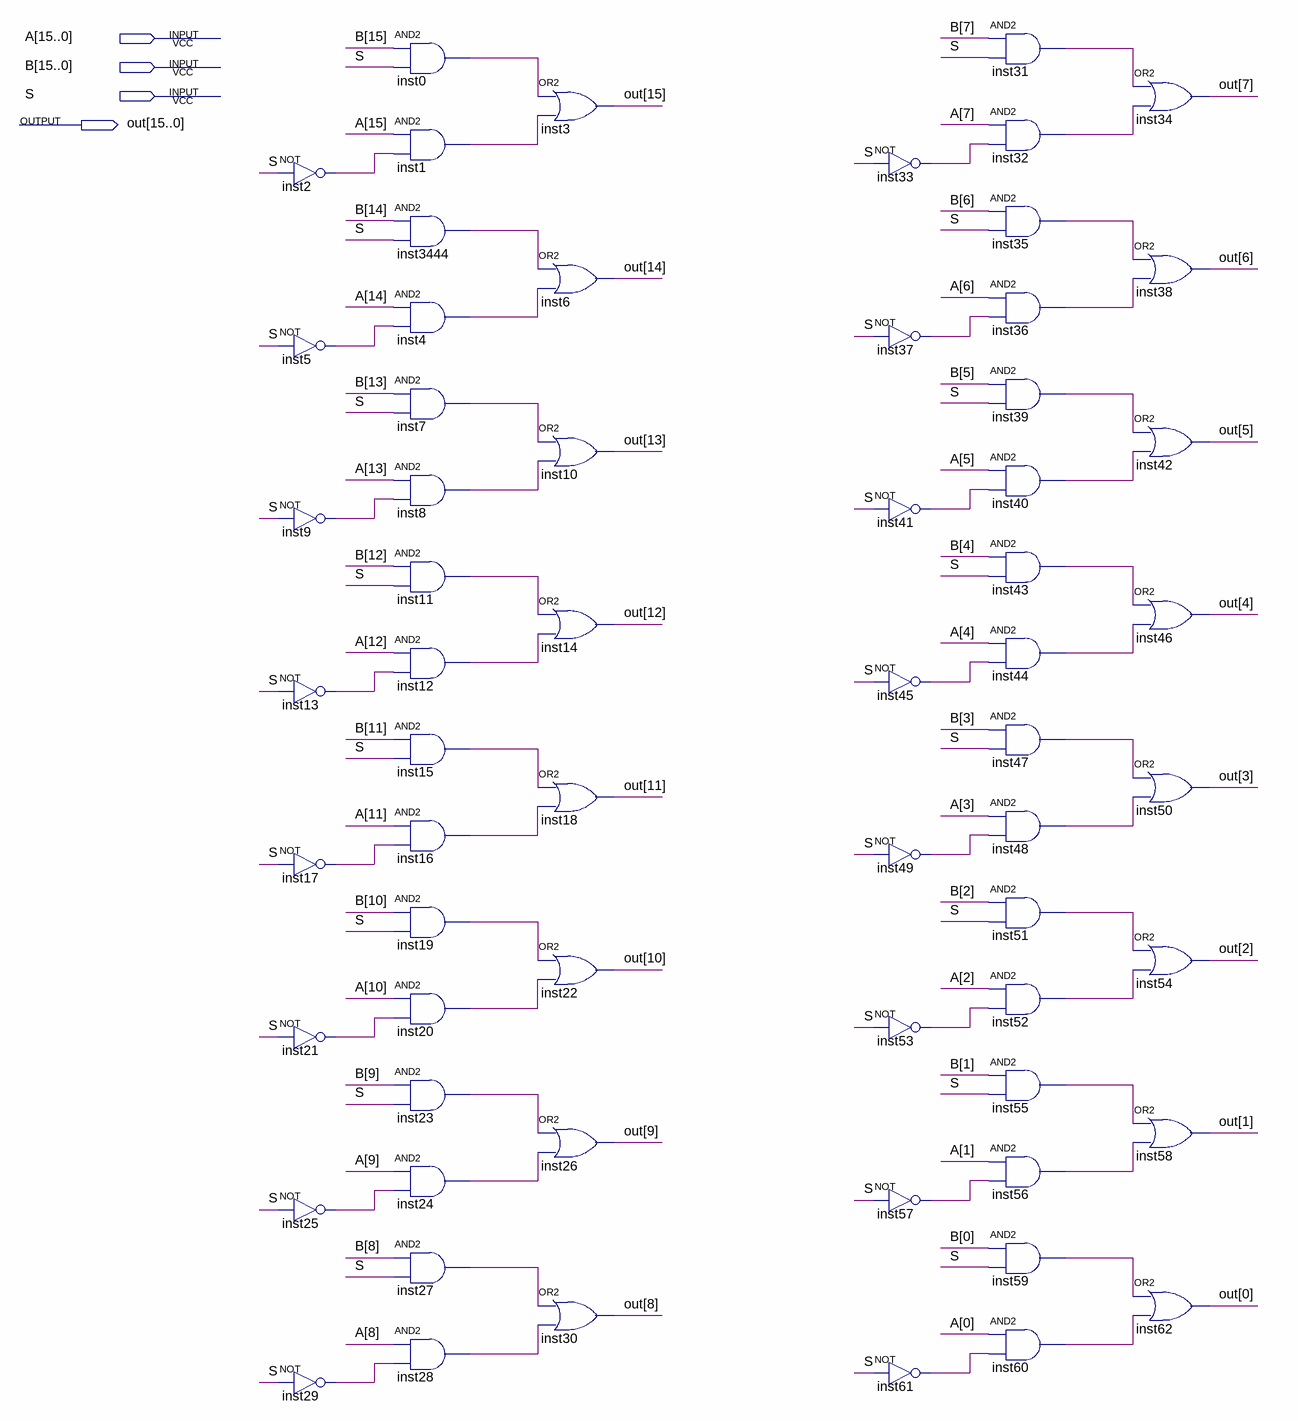
[diagram p0: schematic sheet]
// Quartus schematic multiplexer.bdf as structural Verilog: 64 symbols, 4 pins
module multiplexer (
  input  [15:0] A,
  input  [15:0] B,
  input  S,
  output [15:0] out
);

  wire inst0_out, inst1_out, inst2_out, inst4_out, inst5_out, inst7_out, inst8_out, inst9_out, inst11_out,
       inst12_out, inst13_out, inst15_out, inst16_out, inst17_out, inst19_out, inst20_out, inst21_out,
       inst23_out, inst24_out, inst25_out, inst27_out, inst28_out, inst29_out, inst31_out, inst32_out,
       inst33_out, inst35_out, inst36_out, inst37_out, inst39_out, inst40_out, inst41_out, inst43_out,
       inst44_out, inst45_out, inst47_out, inst48_out, inst49_out, inst51_out, inst52_out, inst53_out,
       inst55_out, inst56_out, inst57_out, inst59_out, inst60_out, inst61_out, inst3444_out;

  not inst2 (inst2_out, S);
  not inst5 (inst5_out, S);
  not inst9 (inst9_out, S);
  not inst13 (inst13_out, S);
  not inst17 (inst17_out, S);
  not inst21 (inst21_out, S);
  not inst25 (inst25_out, S);
  not inst29 (inst29_out, S);
  and inst0 (inst0_out, B[15], S);
  and inst1 (inst1_out, A[15], inst2_out);
  and inst3444 (inst3444_out, B[14], S);
  and inst4 (inst4_out, A[14], inst5_out);
  and inst7 (inst7_out, B[13], S);
  and inst8 (inst8_out, A[13], inst9_out);
  and inst11 (inst11_out, B[12], S);
  and inst12 (inst12_out, A[12], inst13_out);
  and inst15 (inst15_out, B[11], S);
  and inst16 (inst16_out, A[11], inst17_out);
  and inst19 (inst19_out, B[10], S);
  and inst20 (inst20_out, A[10], inst21_out);
  and inst23 (inst23_out, B[9], S);
  and inst24 (inst24_out, A[9], inst25_out);
  and inst27 (inst27_out, B[8], S);
  and inst28 (inst28_out, A[8], inst29_out);
  or inst3 (out[15], inst0_out, inst1_out);
  or inst6 (out[14], inst3444_out, inst4_out);
  or inst10 (out[13], inst7_out, inst8_out);
  or inst14 (out[12], inst11_out, inst12_out);
  or inst18 (out[11], inst15_out, inst16_out);
  or inst22 (out[10], inst19_out, inst20_out);
  or inst26 (out[9], inst23_out, inst24_out);
  or inst30 (out[8], inst27_out, inst28_out);
  not inst33 (inst33_out, S);
  not inst37 (inst37_out, S);
  not inst41 (inst41_out, S);
  not inst45 (inst45_out, S);
  not inst49 (inst49_out, S);
  not inst53 (inst53_out, S);
  not inst57 (inst57_out, S);
  not inst61 (inst61_out, S);
  and inst31 (inst31_out, B[7], S);
  and inst32 (inst32_out, A[7], inst33_out);
  and inst35 (inst35_out, B[6], S);
  and inst36 (inst36_out, A[6], inst37_out);
  and inst39 (inst39_out, B[5], S);
  and inst40 (inst40_out, A[5], inst41_out);
  and inst43 (inst43_out, B[4], S);
  and inst44 (inst44_out, A[4], inst45_out);
  and inst47 (inst47_out, B[3], S);
  and inst48 (inst48_out, A[3], inst49_out);
  and inst51 (inst51_out, B[2], S);
  and inst52 (inst52_out, A[2], inst53_out);
  and inst55 (inst55_out, B[1], S);
  and inst56 (inst56_out, A[1], inst57_out);
  and inst59 (inst59_out, B[0], S);
  and inst60 (inst60_out, A[0], inst61_out);
  or inst34 (out[7], inst31_out, inst32_out);
  or inst38 (out[6], inst35_out, inst36_out);
  or inst42 (out[5], inst39_out, inst40_out);
  or inst46 (out[4], inst43_out, inst44_out);
  or inst50 (out[3], inst47_out, inst48_out);
  or inst54 (out[2], inst51_out, inst52_out);
  or inst58 (out[1], inst55_out, inst56_out);
  or inst62 (out[0], inst59_out, inst60_out);
endmodule
